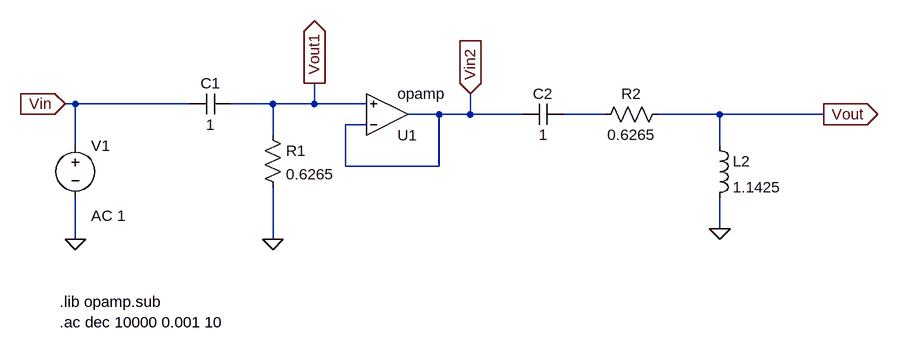
[diagram p0: schematic Ejercicio3-PasaAltos-Cheby-Orden3.asc]
Ejercicio3-PasaAltos-Cheby-Orden3.asc, the LTspice schematic file:
Version 4.1
SHEET 1 1232 680
WIRE -32 48 -48 48
WIRE 144 48 -32 48
WIRE 272 48 208 48
WIRE 336 48 336 16
WIRE 336 48 272 48
WIRE 416 48 336 48
WIRE 528 64 480 64
WIRE 576 64 576 32
WIRE 576 64 528 64
WIRE 656 64 576 64
WIRE 784 64 720 64
WIRE 960 64 864 64
WIRE 1120 64 960 64
WIRE 416 80 384 80
WIRE 272 96 272 48
WIRE -32 112 -32 48
WIRE 960 112 960 64
WIRE 384 144 384 80
WIRE 528 144 528 64
WIRE 528 144 384 144
WIRE 960 240 960 192
WIRE -32 256 -32 192
WIRE 272 256 272 176
FLAG -32 256 0
FLAG 272 256 0
FLAG 960 240 0
FLAG 1120 64 Vout
IOPIN 1120 64 Out
FLAG -48 48 Vin
IOPIN -48 48 In
FLAG 336 16 Vout1
IOPIN 336 16 Out
FLAG 576 32 Vin2
IOPIN 576 32 In
SYMBOL voltage -32 96 R0
WINDOW 123 24 124 Left 2
WINDOW 39 0 0 Left 0
SYMATTR InstName V1
SYMATTR Value ""
SYMATTR Value2 AC 1
SYMBOL cap 208 32 R90
WINDOW 0 0 32 VBottom 2
WINDOW 3 32 32 VTop 2
SYMATTR InstName C1
SYMATTR Value 1
SYMBOL res 256 80 R0
SYMATTR InstName R1
SYMATTR Value 0.6265
SYMBOL OpAmps\\opamp 448 128 M180
SYMATTR InstName U1
SYMBOL cap 720 48 R90
WINDOW 0 0 32 VBottom 2
WINDOW 3 32 32 VTop 2
SYMATTR InstName C2
SYMATTR Value 1
SYMBOL res 880 48 R90
WINDOW 0 0 56 VBottom 2
WINDOW 3 32 56 VTop 2
SYMATTR InstName R2
SYMATTR Value 0.6265
SYMBOL ind 944 96 R0
SYMATTR InstName L2
SYMATTR Value 1.1425
SYMATTR SpiceLine Rser=1m
TEXT -56 352 Left 2 !.lib opamp.sub
TEXT -56 384 Left 2 !.ac dec 10000 0.001 10

The netlist it stands for:
* Ejercicio3-PasaAltos-Cheby-Orden3.asc
V1 Vin 0 AC 1
C1 Vout1 Vin 1
R1 Vout1 0 0.6265
X§U1 Vin2 Vout1 Vin2 opamp Aol=100K GBW=10Meg  ; pins invin noninvin out
C2 N001 Vin2 1
R2 Vout N001 0.6265
L2 Vout 0 1.1425 Rser=1m
.lib opamp.sub
.ac dec 10000 0.001 10
.backanno
.end